# Altium schematic sheet main.SchDoc
size Tabloid; SheetNumber: 1; SheetTotal: 1; Page: Main
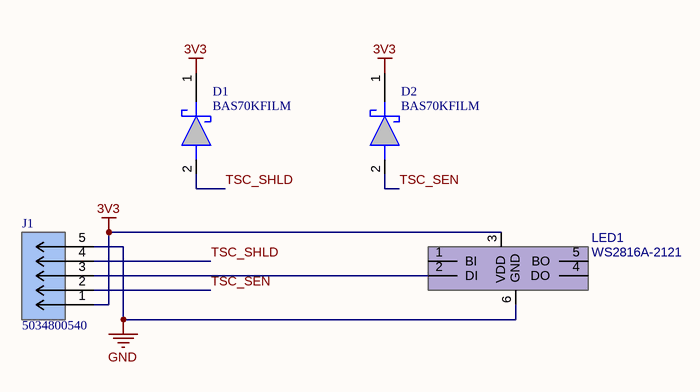
[diagram p0: main.SchDoc]

## Parts
D1  BAS70KFILM  [SODFL1608X70N]
D2  BAS70KFILM  [SODFL1608X70N]
J1  5034800540  [CONN_503480-0540_MOL]
LED1  WS2816A-2121  [ws2816a-2121]

## Nets
3V3: D1.1(K) D2.1(K) J1.1 LED1.3(VDD)
GND: J1.5 LED1.6(GND)
TSC_SEN: D2.2(A) J1.2
TSC_SHLD: D1.2(A) J1.4
NetJ1_3: J1.3 LED1.2(DI)

Not connected (* = marked no-connect by the designer): LED1 1(BI) 4(DO) 5(BO)

## Notes on the sheet
- Board
- Page
- Author
- Date:
- File:

## Library data of the parts
D1 D2 = BAS70KFILM: STMicroelectronics BAS70KFILM, SMT Schottky Diode, 70V 70mA, 2-Pin SOD-523; Geometry.Height: 0.7mm; Manufacturer_Name: STMicroelectronics; Manufacturer_Part_Number: BAS70KFILM; Mouser Part Number: 511-BAS70KFILM; Mouser Price/Stock: https://www.mouser.co.uk/ProductDetail/STMicroelectronics/BAS70KFILM?qs=jZi1jxfVU95GtldeDT2NyQ%3D%3D; Arrow Part Number: BAS70KFILM; Arrow Price/Stock: https://www.arrow.com/en/products/bas70kfilm/stmicroelectronics?region=nac; Datasheet Link: https://www.st.com/resource/en/datasheet/bas70.pdf
J1 = 5034800540: Easy-On FFC/FPC Connector, 0.50mm Pitch, FBH1 Series, Right-Angle, Dual Contact, 1.00mm Height, 5 Circuits, Gold over Nickel Plating; Manufacturer_Name: Molex Connector Corporation; Copyright: Copyright (C) 2025 Ultra Librarian. All rights reserved.; Manufacturer_Part_Number: 5034800540; RefDes: RefDes; Type: Type
LED1 = WS2816A-2121: Manufacturer_Part_Number: WS2816A-2121